# EAGLE design RadioAdapterBoardV3_0 (EAGLE 7.3.0)
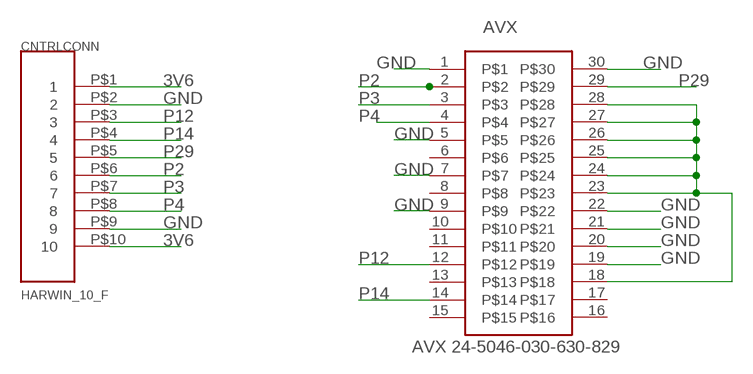
[diagram p0: schematic, sheet 1]

## Parts
AVX  AVX-24-5046-030-630-829  [AVX-24-5046-630-829]
CNTRLCONN  HARWIN_10_F  [HARWIN_DATAMATE_10_F]

## Nets
3V6: AVX.18 AVX.23 AVX.24 AVX.25 AVX.26 AVX.27 AVX.28 CNTRLCONN.P$1 CNTRLCONN.P$10
GND: AVX.1 AVX.5 AVX.7 AVX.9 AVX.19 AVX.20 AVX.21 AVX.22 AVX.30 CNTRLCONN.P$2 CNTRLCONN.P$9
P2: AVX.2 CNTRLCONN.P$6
P3: AVX.3 CNTRLCONN.P$7
P4: AVX.4 CNTRLCONN.P$8
P12: AVX.12 CNTRLCONN.P$3
P14: AVX.14 CNTRLCONN.P$4
P29: AVX.29 CNTRLCONN.P$5
Unconnected: AVX.6 AVX.8 AVX.10 AVX.11 AVX.13 AVX.15 AVX.16 AVX.17

## Library data of the parts
AVX = CNTRL_BOARD:AVX-24-5046-030-630-829
CNTRLCONN = CNTRL_BOARD:HARWIN_10_F

## Board
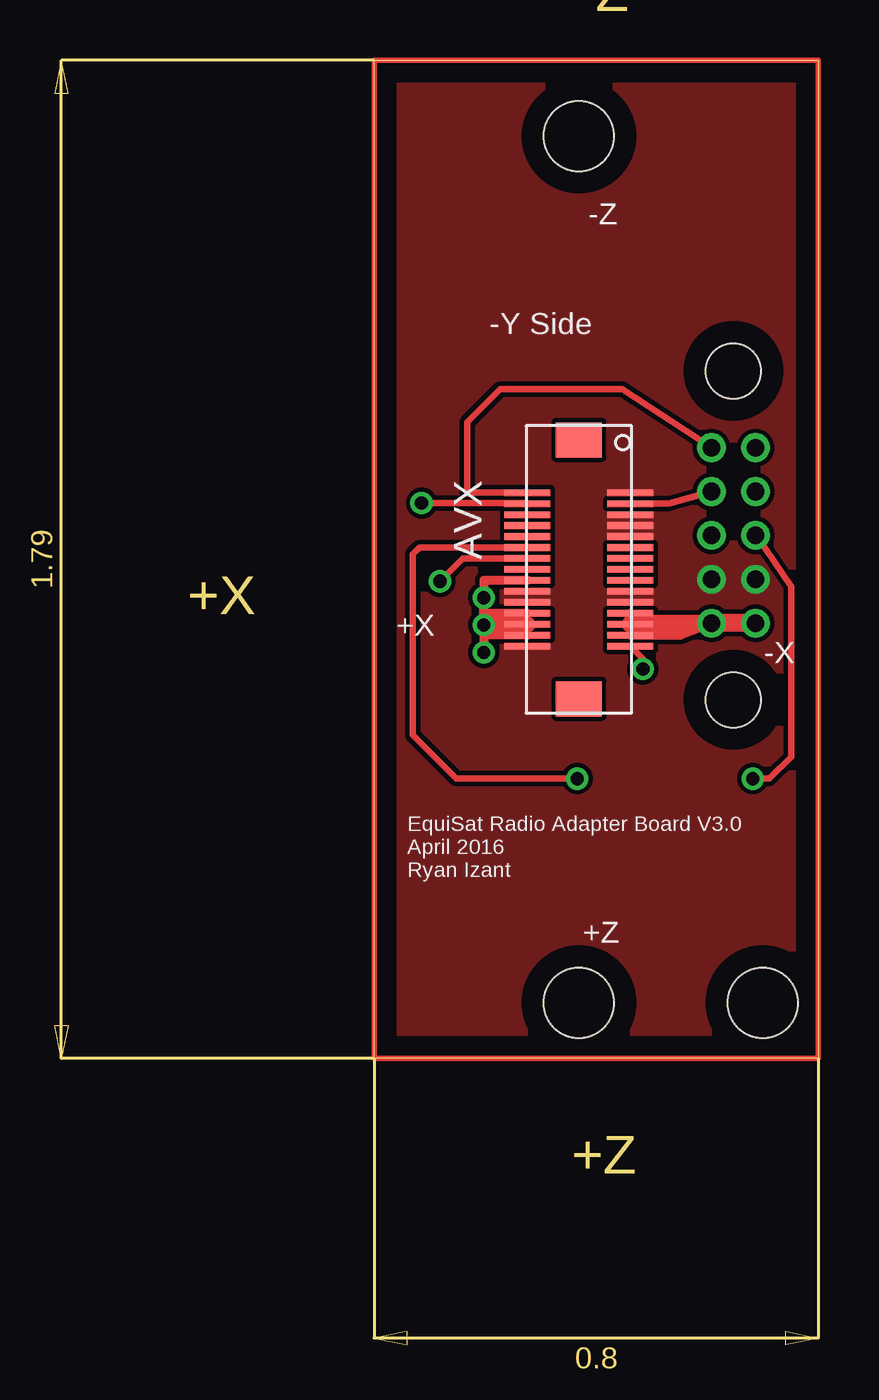
[diagram p1: board, top side]
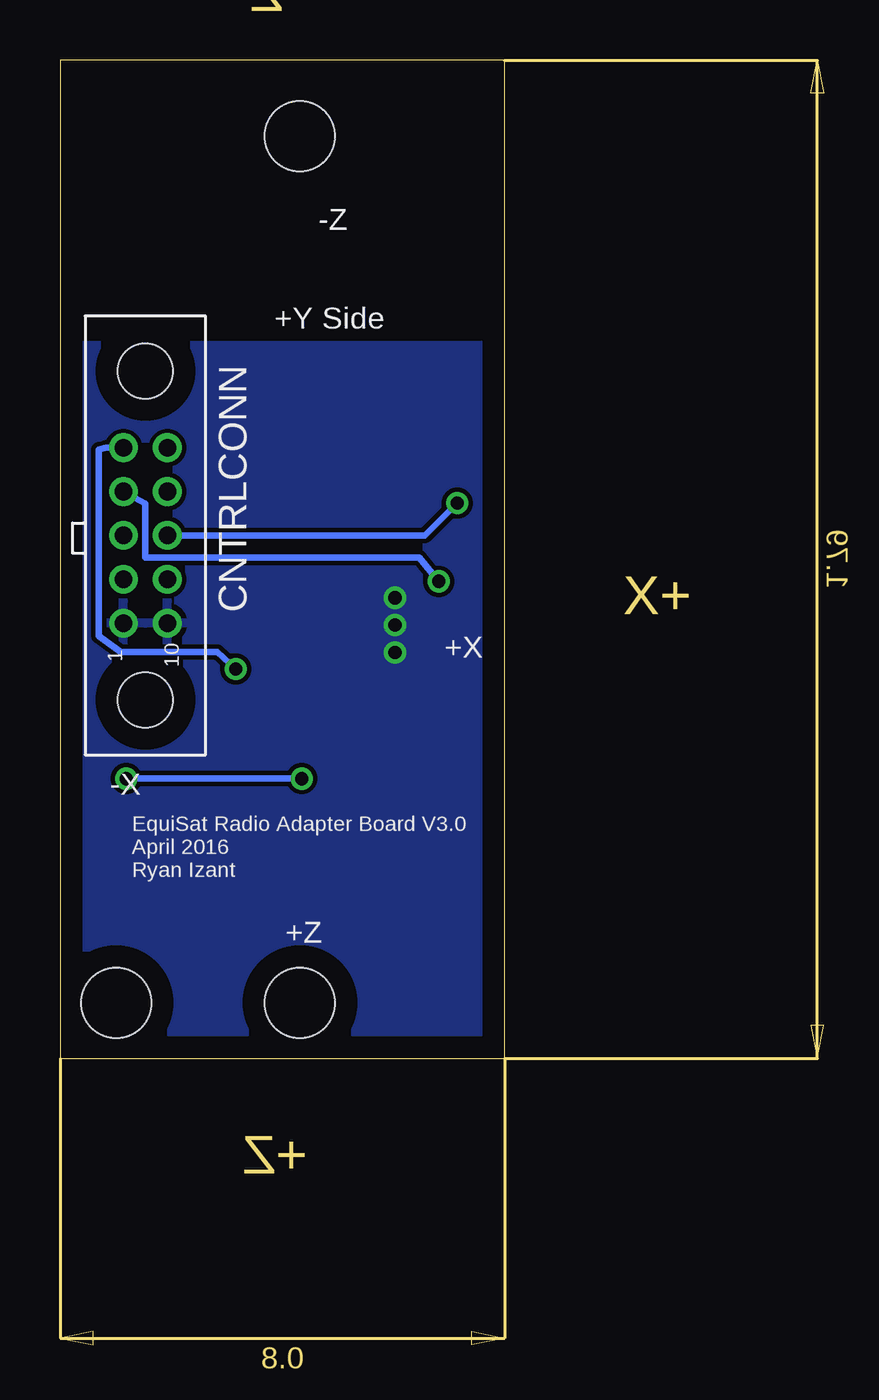
[diagram p2: board, bottom side, seen from below]

Size 20.25 x 45.5 mm. Coordinates in mm from the lower left corner, seen from the top.
Outline: 20.25,0 0,0 0,45.5 20.25,45.5 20.25,0
Copper layers (1*16): Top 0.035mm / dielectric 1.5mm / Bottom 0.035mm
Design rules "default": minimum track width 10mil, minimum drill 24mil, track to track 8mil, track to pad 8mil, pad to pad 8mil, via to via 8mil, smd to smd 8mil, copper to edge 40mil, drill to drill 8mil, minimum pad ring 10mil, minimum via ring 8mil, stop-mask expansion 4mil, vias tented up to drill 0mil, thermal gap 10mil
Holes 3.18 mm at 17.71,2.54 9.33,2.54 9.33,42.04

### Footprints (pad centres in the part's own frame; a part is rotated, then mirrored left to right if it is on the bottom)
AVX-24-5046-630-829 = smd 0.3 x 2.1: 1 3.5,-2.35; 2 3.5,2.35; 3 3,-2.35; 4 3,2.35; 5 2.5,-2.35; 6 2.5,2.35; 7 2,-2.35; 8 2,2.35; 9 1.5,-2.35; 10 1.5,2.35; 11 1,-2.35; 12 1,2.35; 13 0.5,-2.35; 14 0.5,2.35; 15 0,-2.35; 16 0,2.35; 17 -0.5,-2.35; 18 -0.5,2.35; 19 -1,-2.35; 20 -1,2.35; 21 -1.5,-2.35; 22 -1.5,2.35; 23 -2,-2.35; 24 -2,2.35; 25 -2.5,-2.35; 26 -2.5,2.35; 27 -3,-2.35; 28 -3,2.35; 29 -3.5,-2.35; 30 -3.5,2.35 | smd 1.6 x 2.1: P$31 -5.9,0; P$32 5.9,0
HARWIN_DATAMATE_10_F = drill 0.8: P$1 0,-0.02; P$2 2,-0.02; P$3 4,-0.02; P$4 6,-0.02; P$5 8,-0.02; P$6 8,-2.02; P$7 6,-2.02; P$8 4,-2.02; P$9 2,-2.02; P$10 0,-2.02 | hole 2.5: -3.5,-1.02; 11.5,-1.02

### Placement (x,y rotation side)
AVX  9.33,22.29 90 top
CNTRLCONN  17.39,19.84 90 bottom

### Tracks (layer width: path | path; a pad name or v marks a point on that pad's centre or on a via)
3V6  (via drill 0.6)
  Top 0.406: AVX.28 5,19.29 v5,18.5
  Top 0.41: AVX.24 5,20.29 v5,21 5,21.79 AVX.18 | AVX.23 11.7,19.84 | AVX.27 13.97,19.29 CNTRLCONN.P$10
  Top 0.76: AVX.26 5,19.79 v5,19.75 | CNTRLCONN.P$10 11.7,19.84 AVX.25
  Top 0.813: CNTRLCONN.P$1 15.25,19.84 15.25,19.75
  pour Bottom: -2.5,32.5 24.25,32.5 24,-1.25 -3,-1.25
GND
  pour Top (no thermals): -3.25,49 23.75,48.5 24.25,-1.75 -2.75,-1.25
N$1
  Top 0.25: 20.25,0 0,0 0,45.5 20.25,45.5 20.25,0
P2
  Top 0.3: AVX.2 4.29,25.79 4.25,25.75 4.25,29 5.75,30.5 11.31,30.5 CNTRLCONN.P$6
P3
  Top 0.3: AVX.3 13.42,25.29 CNTRLCONN.P$7
P4  (via drill 0.6)
  Top 0.3: v2.16,25.32 6.97,25.32 AVX.4
  Bottom 0.3: CNTRLCONN.P$8 3.64,23.84 v2.16,25.32
P12  (via drill 0.6)
  Top 0.3: AVX.12 2.09,23.29 2.05,23.25 2,23.25 1.75,23 1.75,14.75 | CNTRLCONN.P$3 17.47,23.78 19,21.5 19,13.75
  Top 0.305: 1.75,14.75 3.75,12.75 v9.25,12.75 | v17.25,12.75 18,12.75 19,13.75
  Bottom 0.305: v9.25,12.75 v17.25,12.75
P14  (via drill 0.6)
  Top 0.3: v3,21.75 4.04,22.79 AVX.14
  Bottom 0.3: CNTRLCONN.P$4 16.39,25.29 16.38,24.47 16.38,22.83 3.89,22.83 v3,21.75
P29  (via drill 0.6)
  Top 0.3: v12.25,17.75 12.25,18.24 AVX.29
  Bottom 0.3: CNTRLCONN.P$5 18.16,27.84 18.5,27.75 18.5,19.25 17.5,18.53 14,18.53 13.09,18.52 v12.25,17.75

### Text on the board
Dimension: -Z | -X | +X | +Z
tPlace: -Z | -Y Side | +X | -X | EquiSat Radio Adapter Board V3.0 / April 2016 / Ryan Izant | +Z
bPlace: -Z | +Y Side | +X | -X | EquiSat Radio Adapter Board V3.0 / April 2016 / Ryan Izant | +Z